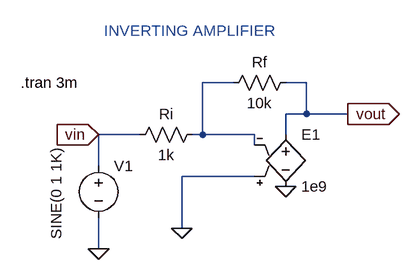
[diagram p0: schematic Inverting_Amplifier.asc]
Inverting_Amplifier.asc, the LTspice schematic file:
Version 4
SHEET 1 880 680
WIRE 224 32 176 32
WIRE 336 32 304 32
WIRE 336 80 336 32
WIRE 336 80 304 80
WIRE 400 80 336 80
WIRE 80 112 16 112
WIRE 176 112 176 32
WIRE 176 112 160 112
WIRE 256 112 176 112
WIRE 304 112 304 80
WIRE 256 128 256 112
WIRE 16 160 16 112
WIRE 256 176 144 176
WIRE 144 256 144 176
WIRE 16 288 16 240
FLAG 304 192 0
FLAG 16 288 0
FLAG 400 80 vout
IOPIN 400 80 Out
FLAG 144 256 0
FLAG 16 112 vin
IOPIN 16 112 In
SYMBOL voltage 16 144 R0
WINDOW 3 -65 -12 VRight 2
WINDOW 123 0 0 Left 0
WINDOW 39 0 0 Left 0
SYMATTR InstName V1
SYMATTR Value SINE(0 1 1K)
SYMBOL e2 304 96 R0
SYMATTR InstName E1
SYMATTR Value 1e9
SYMBOL res 176 96 R90
WINDOW 0 0 56 VBottom 2
WINDOW 3 32 56 VTop 2
SYMATTR InstName Ri
SYMATTR Value 1k
SYMBOL res 320 16 R90
WINDOW 0 0 56 VBottom 2
WINDOW 3 32 56 VTop 2
SYMATTR InstName Rf
SYMATTR Value 10k
TEXT -104 32 Left 2 !.tran 3m
TEXT 24 -48 Left 2 ;INVERTING AMPLIFIER

The netlist it stands for:
* Inverting_Amplifier.asc
V1 vin 0 SINE(0 1 1K)
E1 vout 0 0 N001 1e9
Ri N001 vin 1k
Rf vout N001 10k
.tran 3m
* INVERTING AMPLIFIER
.backanno
.end